# Altium project HPBIController.PrjPCB (part 1 of 5)
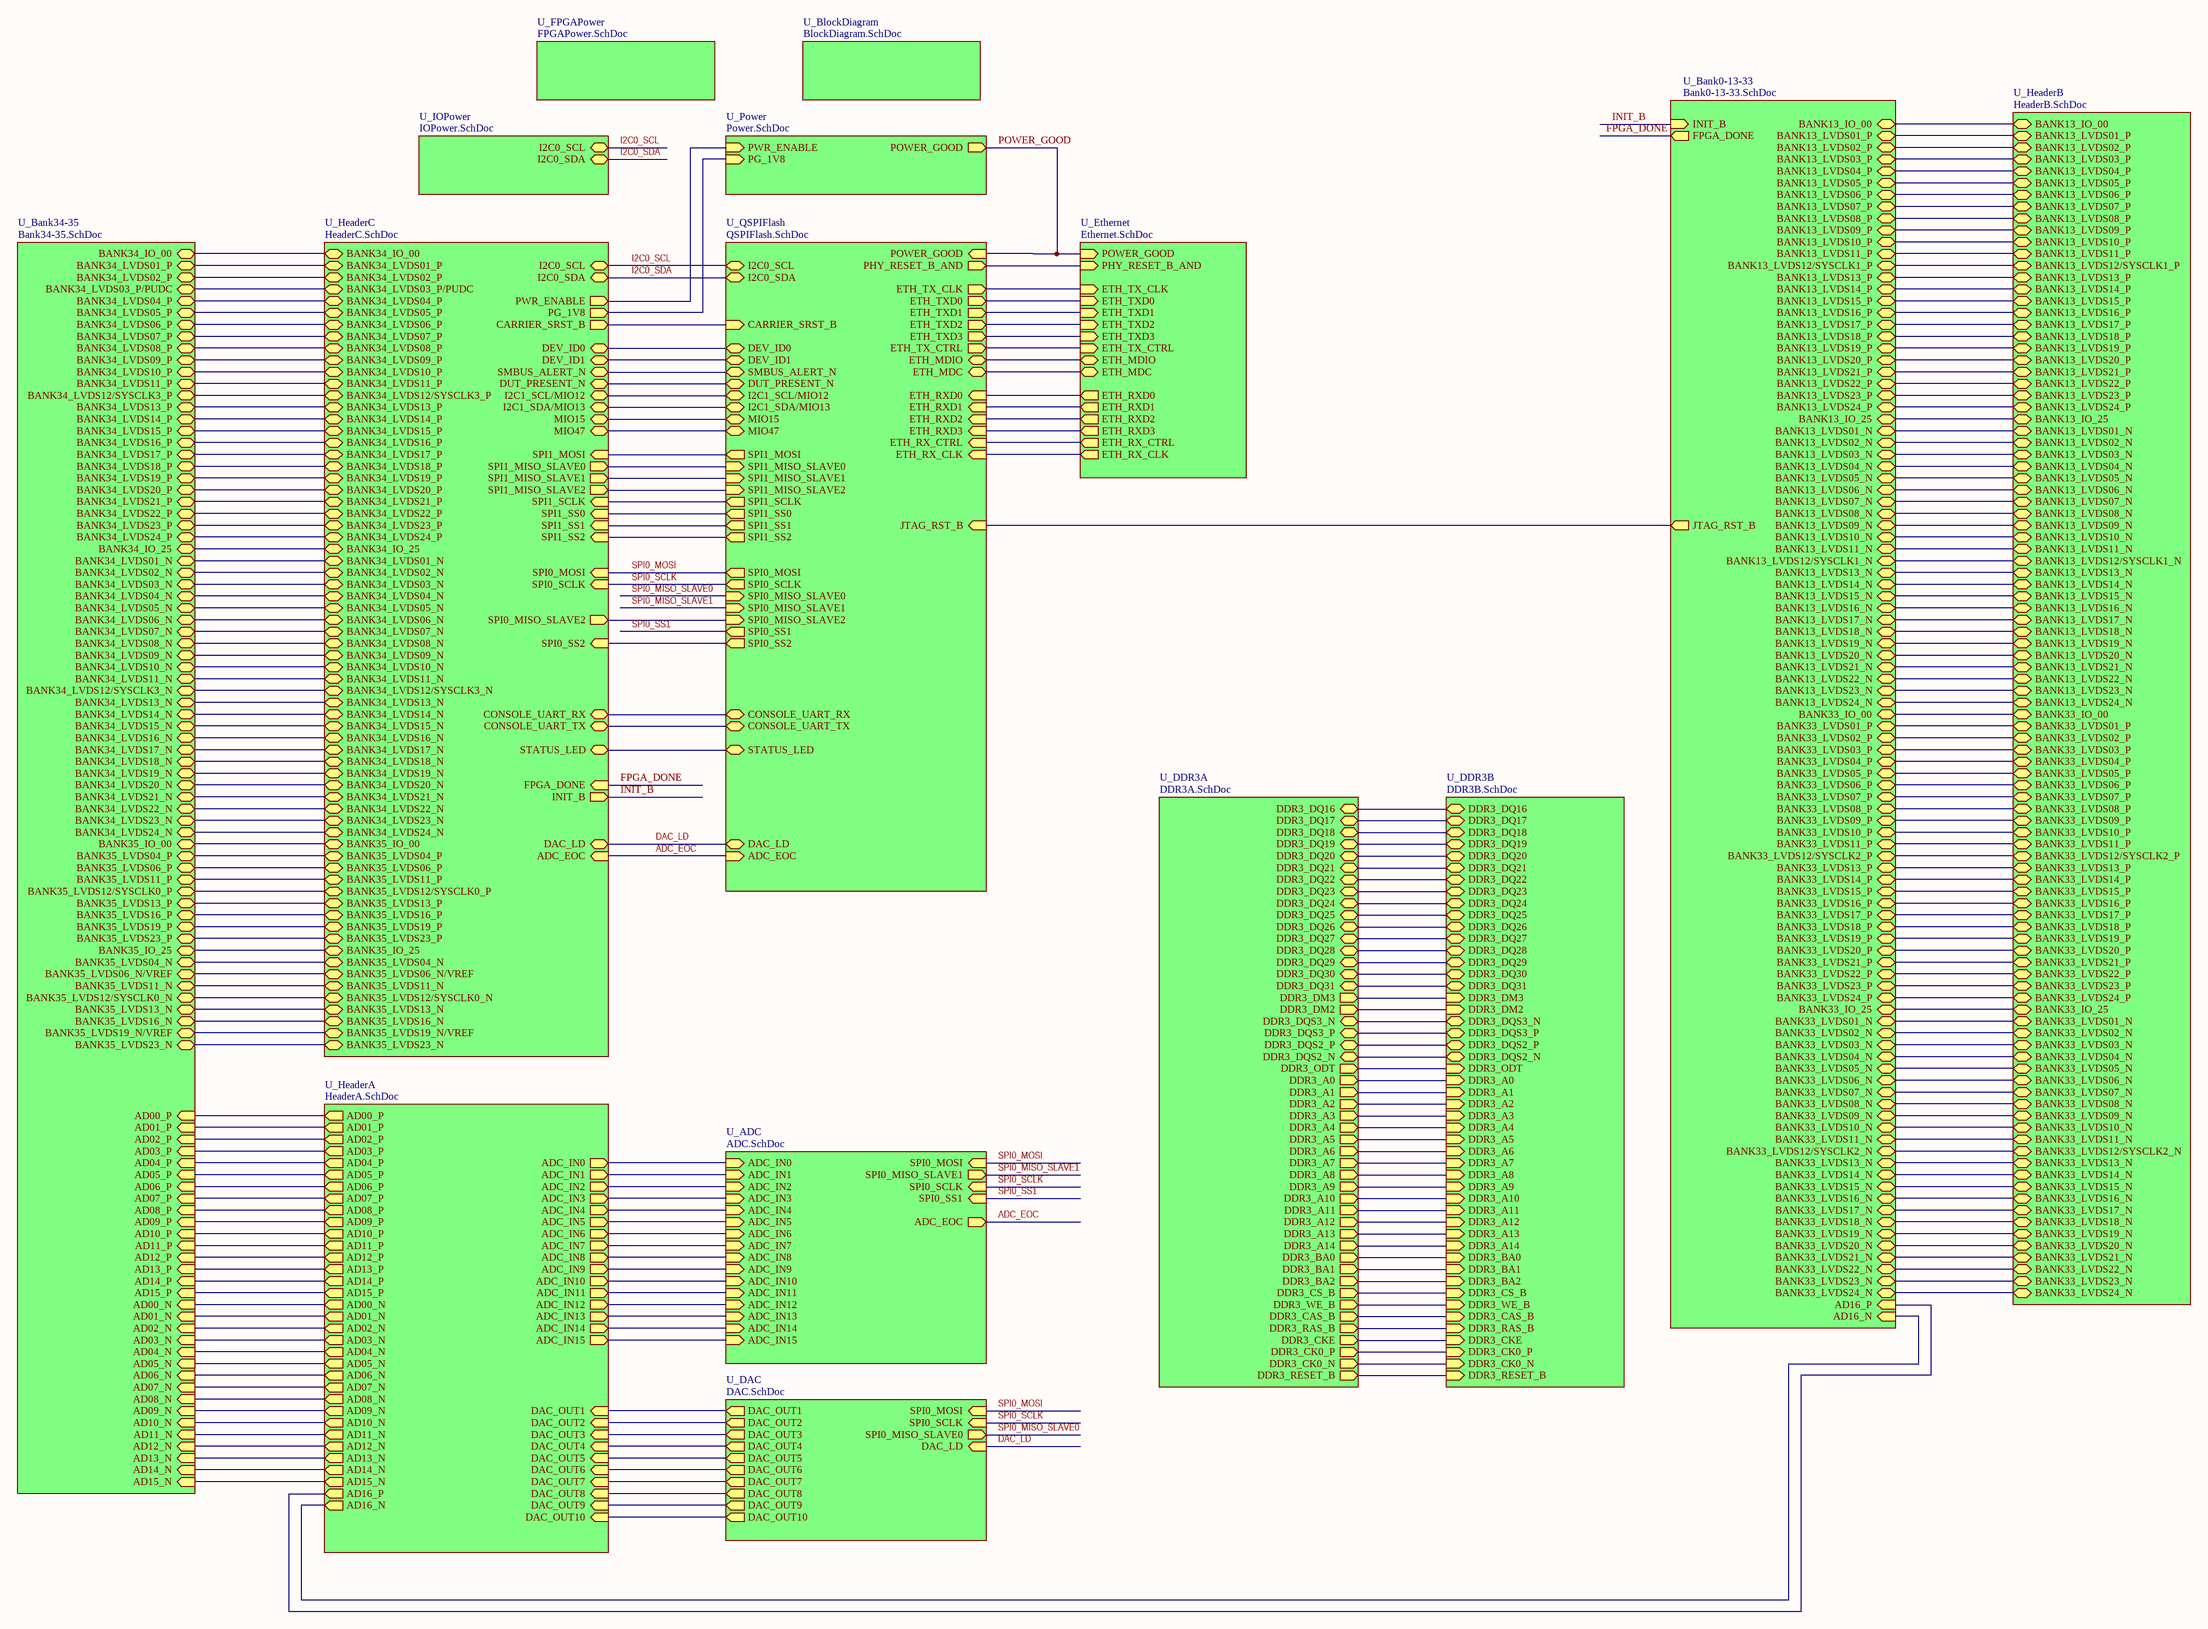
[diagram p0: Top.SchDoc]
10 sheets, 294 parts. Net scope: hierarchical (ports join the sheet entries above them; power ports are global).
Board file: HPBIController.PcbDoc
Sheets:
  Top.SchDoc
    U_Bank0-13-33 = Bank0-13-33.SchDoc
    U_DDR3A = DDR3A.SchDoc
    U_Ethernet = Ethernet.SchDoc
    U_FPGAPower = FPGAPower.SchDoc
    U_HeaderA = HeaderA.SchDoc
    U_HeaderB = HeaderB.SchDoc
    U_HeaderC = HeaderC.SchDoc
    U_IOPower = IOPower.SchDoc
    U_QSPIFlash = QSPIFlash.SchDoc

## Sheet Top.SchDoc: 02290_Sonoma_Controller
size C; ApprovedBy: J Johnson; CheckedBy: J Johnson; Author: sdfasdfdfAEFfasdFfaF; DrawnBy: J Johnson; Organization: Opsero Electronic Design; Address1: 21-915 Av. Marguerite-Bourgeoys; Address2: Québec (QC); Address3: G1S 3X4; DocumentNumber: OP009-001-SCH; Revision: B-1; SheetNumber: 01; SheetTotal: 16; Tel1: (581) 308-8830; Tel2: (581) 308-8830; Project: 02290_Sonoma_Controller; CheckedDate: yyyy-mm-dd; Sheet: Block diagram; PageSetup: Record=PageOptions|CenterHorizontal=True|CenterVertical=True|PrintScale=1.08|XCorrection=1.00|YCorrection=1.00|PrintKind=0|BorderSize=5000000|LeftOffset=0|BottomOffset=0|Orientation=2|PaperLength=1000|PaperWidth=1000|Scale=100|PaperSource=7|PrintQuality=-4|MediaType=1|DitherType=10|PaperKind=Tabloid     [11 x 17 in]|PrintScaleMode=1; DrawDate: 2013-12-13; SchTitle: 02290_Sonoma_Controller; RevDescription: Removed QSPI, JP4/5, temp mon, JP6, U31; RevDate: 2019-05-24; RevBy: J Johnson; RevDescription2: Replaced D1 with RB521S30, J2 with L834-1G1T-S7; RevDescription3: Replaced FETs with TSM900N06CW RPG

### Sub-sheets
U_ADC = ADC.SchDoc (file not in this document): SPI0_MOSI (in), SPI0_MISO_SLAVE1 (out), SPI0_SCLK (in), SPI0_SS1 (in), ADC_IN0 (in), ADC_IN1 (in), ADC_IN2 (in), ADC_IN3 (in), ADC_IN4 (in), ADC_IN5 (in), ADC_IN6 (in), ADC_IN7 (in), ADC_IN8 (in), ADC_IN9 (in), ADC_IN10 (in), ADC_IN11 (in), ADC_IN12 (in), ADC_IN13 (in), ADC_IN14 (in), ADC_IN15 (in), ADC_EOC (out)
U_Bank0-13-33 = Bank0-13-33.SchDoc: FPGA_DONE (out), INIT_B (in), BANK13_IO_00 (bidir), BANK13_LVDS01_P (bidir), BANK13_LVDS02_P (bidir), BANK13_LVDS03_P (bidir), BANK13_LVDS04_P (bidir), BANK13_LVDS05_P (bidir), BANK13_LVDS06_P (bidir), BANK13_LVDS07_P (bidir), BANK13_LVDS08_P (bidir), BANK13_LVDS09_P (bidir), BANK13_LVDS10_P (bidir), BANK13_LVDS11_P (bidir), BANK13_LVDS13_P (bidir), BANK13_LVDS14_P (bidir), BANK13_LVDS15_P (bidir), BANK13_LVDS16_P (bidir), BANK13_LVDS17_P (bidir), BANK13_LVDS18_P (bidir), BANK13_LVDS19_P (bidir), BANK13_LVDS20_P (bidir), BANK13_LVDS21_P (bidir), BANK13_LVDS22_P (bidir), BANK13_LVDS23_P (bidir), BANK13_LVDS24_P (bidir), BANK13_IO_25 (bidir), BANK13_LVDS01_N (bidir), BANK13_LVDS02_N (bidir), BANK13_LVDS03_N (bidir), BANK13_LVDS04_N (bidir), BANK13_LVDS05_N (bidir), BANK13_LVDS06_N (bidir), BANK13_LVDS07_N (bidir), BANK13_LVDS08_N (bidir), BANK13_LVDS09_N (bidir), BANK13_LVDS10_N (bidir), BANK13_LVDS11_N (bidir), BANK13_LVDS13_N (bidir), BANK13_LVDS14_N (bidir), BANK13_LVDS15_N (bidir), BANK13_LVDS16_N (bidir), BANK13_LVDS17_N (bidir), BANK13_LVDS18_N (bidir), BANK13_LVDS19_N (bidir), BANK13_LVDS20_N (bidir), BANK13_LVDS21_N (bidir), BANK13_LVDS22_N (bidir), BANK13_LVDS23_N (bidir), BANK13_LVDS24_N (bidir), BANK33_IO_00 (bidir), BANK33_LVDS01_P (bidir), BANK33_LVDS02_P (bidir), BANK33_LVDS03_P (bidir), BANK33_LVDS04_P (bidir), BANK33_LVDS05_P (bidir), BANK33_LVDS06_P (bidir), BANK33_LVDS07_P (bidir), BANK33_LVDS08_P (bidir), BANK33_LVDS09_P (bidir), BANK33_LVDS10_P (bidir), BANK33_LVDS11_P (bidir), BANK33_LVDS13_P (bidir), BANK33_LVDS14_P (bidir), BANK33_LVDS15_P (bidir), BANK33_LVDS16_P (bidir), BANK33_LVDS17_P (bidir), BANK33_LVDS18_P (bidir), BANK33_LVDS19_P (bidir), BANK33_LVDS20_P (bidir), BANK33_LVDS21_P (bidir), BANK33_LVDS22_P (bidir), BANK33_LVDS23_P (bidir), BANK33_LVDS24_P (bidir), BANK33_IO_25 (bidir), BANK33_LVDS01_N (bidir), BANK33_LVDS02_N (bidir), BANK33_LVDS03_N (bidir), BANK33_LVDS04_N (bidir), BANK33_LVDS05_N (bidir), BANK33_LVDS06_N (bidir), BANK33_LVDS07_N (bidir), BANK33_LVDS08_N (bidir), BANK33_LVDS09_N (bidir), BANK33_LVDS10_N (bidir), BANK33_LVDS11_N (bidir), BANK33_LVDS13_N (bidir), BANK33_LVDS14_N (bidir), BANK33_LVDS15_N (bidir), BANK33_LVDS16_N (bidir), BANK33_LVDS17_N (bidir), BANK33_LVDS18_N (bidir), BANK33_LVDS19_N (bidir), BANK33_LVDS20_N (bidir), BANK33_LVDS21_N (bidir), BANK33_LVDS22_N (bidir), BANK33_LVDS23_N (bidir), BANK33_LVDS24_N (bidir), AD16_P (in), AD16_N (in), JTAG_RST_B (out), BANK13_LVDS12/SYSCLK1_P (bidir), BANK13_LVDS12/SYSCLK1_N (bidir), BANK33_LVDS12/SYSCLK2_P (bidir), BANK33_LVDS12/SYSCLK2_N (bidir)
U_Bank34-35 = Bank34-35.SchDoc (file not in this document): BANK34_IO_00 (bidir), BANK34_LVDS01_P (bidir), BANK34_LVDS02_P (bidir), BANK34_LVDS03_P/PUDC (bidir), BANK34_LVDS04_P (bidir), BANK34_LVDS05_P (bidir), BANK34_LVDS06_P (bidir), BANK34_LVDS07_P (bidir), BANK34_LVDS08_P (bidir), BANK34_LVDS09_P (bidir), BANK34_LVDS10_P (bidir), BANK34_LVDS11_P (bidir), BANK34_LVDS13_P (bidir), BANK34_LVDS14_P (bidir), BANK34_LVDS15_P (bidir), BANK34_LVDS16_P (bidir), BANK34_LVDS17_P (bidir), BANK34_LVDS18_P (bidir), BANK34_LVDS19_P (bidir), BANK34_LVDS20_P (bidir), BANK34_LVDS21_P (bidir), BANK34_LVDS22_P (bidir), BANK34_LVDS23_P (bidir), BANK34_LVDS24_P (bidir), BANK34_IO_25 (bidir), BANK34_LVDS01_N (bidir), BANK34_LVDS02_N (bidir), BANK34_LVDS03_N (bidir), BANK34_LVDS04_N (bidir), BANK34_LVDS05_N (bidir), BANK34_LVDS06_N (bidir), BANK34_LVDS07_N (bidir), BANK34_LVDS08_N (bidir), BANK34_LVDS09_N (bidir), BANK34_LVDS10_N (bidir), BANK34_LVDS11_N (bidir), BANK34_LVDS13_N (bidir), BANK34_LVDS14_N (bidir), BANK34_LVDS15_N (bidir), BANK34_LVDS16_N (bidir), BANK34_LVDS17_N (bidir), BANK34_LVDS18_N (bidir), BANK34_LVDS19_N (bidir), BANK34_LVDS20_N (bidir), BANK34_LVDS21_N (bidir), BANK34_LVDS22_N (bidir), BANK34_LVDS23_N (bidir), BANK34_LVDS24_N (bidir), BANK35_IO_00 (bidir), BANK35_LVDS04_P (bidir), BANK35_LVDS06_P (bidir), BANK35_LVDS11_P (bidir), BANK35_LVDS13_P (bidir), BANK35_LVDS16_P (bidir), BANK35_LVDS19_P (bidir), BANK35_LVDS23_P (bidir), BANK35_IO_25 (bidir), BANK35_LVDS04_N (bidir), BANK35_LVDS06_N/VREF (bidir), BANK35_LVDS11_N (bidir), BANK35_LVDS13_N (bidir), BANK35_LVDS16_N (bidir), BANK35_LVDS19_N/VREF (bidir), BANK35_LVDS23_N (bidir), AD00_P (in), AD01_P (in), AD02_P (in), AD03_P (in), AD04_P (in), AD05_P (in), AD06_P (in), AD07_P (in), AD08_P (in), AD09_P (in), AD10_P (in), AD11_P (in), AD12_P (in), AD13_P (in), AD14_P (in), AD15_P (in), AD00_N (in), AD01_N (in), AD02_N (in), AD03_N (in), AD04_N (in), AD05_N (in), AD06_N (in), AD07_N (in), AD08_N (in), AD09_N (in), AD10_N (in), AD11_N (in), AD12_N (in), AD13_N (in), AD14_N (in), AD15_N (in), BANK34_LVDS12/SYSCLK3_P (bidir), BANK34_LVDS12/SYSCLK3_N (bidir), BANK35_LVDS12/SYSCLK0_P (bidir), BANK35_LVDS12/SYSCLK0_N (bidir)
U_BlockDiagram = BlockDiagram.SchDoc (file not in this document): no entries
U_DAC = DAC.SchDoc (file not in this document): DAC_OUT1 (out), DAC_OUT2 (out), DAC_OUT3 (out), DAC_OUT4 (out), DAC_OUT5 (out), DAC_OUT6 (out), DAC_OUT7 (out), DAC_OUT8 (out), DAC_OUT9 (out), DAC_OUT10 (out), SPI0_MOSI (in), SPI0_SCLK (in), DAC_LD (in), SPI0_MISO_SLAVE0 (out)
U_DDR3A = DDR3A.SchDoc: DDR3_DQ16 (bidir), DDR3_DQ17 (bidir), DDR3_DQ18 (bidir), DDR3_DQ19 (bidir), DDR3_DQ20 (bidir), DDR3_DQ21 (bidir), DDR3_DQ22 (bidir), DDR3_DQ23 (bidir), DDR3_DQ24 (bidir), DDR3_DQ25 (bidir), DDR3_DQ26 (bidir), DDR3_DQ27 (bidir), DDR3_DQ28 (bidir), DDR3_DQ29 (bidir), DDR3_DQ30 (bidir), DDR3_DQ31 (bidir), DDR3_DM2 (out), DDR3_DM3 (out), DDR3_DQS2_P (bidir), DDR3_DQS2_N (bidir), DDR3_DQS3_N (bidir), DDR3_DQS3_P (bidir), DDR3_A0 (out), DDR3_A1 (out), DDR3_A2 (out), DDR3_A3 (out), DDR3_A4 (out), DDR3_A5 (out), DDR3_A6 (out), DDR3_A7 (out), DDR3_A8 (out), DDR3_A9 (out), DDR3_A10 (out), DDR3_A11 (out), DDR3_A12 (out), DDR3_A13 (out), DDR3_A14 (out), DDR3_BA0 (out), DDR3_BA1 (out), DDR3_BA2 (out), DDR3_CK0_P (out), DDR3_CK0_N (out), DDR3_CKE (out), DDR3_CS_B (out), DDR3_RAS_B (out), DDR3_CAS_B (out), DDR3_WE_B (out), DDR3_ODT (out), DDR3_RESET_B (out)
U_DDR3B = DDR3B.SchDoc (file not in this document): DDR3_DQ24 (bidir), DDR3_DQ25 (bidir), DDR3_DQ26 (bidir), DDR3_DQ27 (bidir), DDR3_DQ28 (bidir), DDR3_DQ29 (bidir), DDR3_DQ30 (bidir), DDR3_DQ31 (bidir), DDR3_DQ16 (bidir), DDR3_DQ17 (bidir), DDR3_DQ18 (bidir), DDR3_DQ19 (bidir), DDR3_DQ20 (bidir), DDR3_DQ21 (bidir), DDR3_DQ22 (bidir), DDR3_DQ23 (bidir), DDR3_DM3 (in), DDR3_DM2 (in), DDR3_DQS3_N (bidir), DDR3_DQS3_P (bidir), DDR3_DQS2_P (bidir), DDR3_DQS2_N (bidir), DDR3_ODT (in), DDR3_A0 (in), DDR3_A1 (in), DDR3_A2 (in), DDR3_A3 (in), DDR3_A4 (in), DDR3_A5 (in), DDR3_A6 (in), DDR3_A7 (in), DDR3_A8 (in), DDR3_A9 (in), DDR3_A10 (in), DDR3_A11 (in), DDR3_A12 (in), DDR3_A13 (in), DDR3_A14 (in), DDR3_BA0 (in), DDR3_BA1 (in), DDR3_BA2 (in), DDR3_CS_B (in), DDR3_WE_B (in), DDR3_CAS_B (in), DDR3_RAS_B (in), DDR3_CKE (in), DDR3_CK0_P (in), DDR3_CK0_N (in), DDR3_RESET_B (in)
U_Ethernet = Ethernet.SchDoc: POWER_GOOD (in), ETH_TX_CLK (in), ETH_TXD0 (in), ETH_TXD1 (in), ETH_TXD2 (in), ETH_TXD3 (in), ETH_RXD0 (out), ETH_RXD1 (out), ETH_RXD2 (out), ETH_RXD3 (out), ETH_TX_CTRL (in), ETH_RX_CTRL (out), ETH_RX_CLK (out), ETH_MDIO (bidir), ETH_MDC (bidir), PHY_RESET_B_AND (in)
U_FPGAPower = FPGAPower.SchDoc: no entries
U_HeaderA = HeaderA.SchDoc: AD00_P (out), AD01_P (out), AD02_P (out), AD03_P (out), AD04_P (out), AD05_P (out), AD06_P (out), AD07_P (out), AD08_P (out), AD09_P (out), AD10_P (out), AD11_P (out), AD12_P (out), AD13_P (out), AD14_P (out), AD15_P (out), AD00_N (out), AD01_N (out), AD02_N (out), AD03_N (out), AD04_N (out), AD05_N (out), AD06_N (out), AD07_N (out), AD08_N (out), AD09_N (out), AD10_N (out), AD11_N (out), AD12_N (out), AD13_N (out), AD14_N (out), AD15_N (out), AD16_P (out), AD16_N (out), DAC_OUT1 (in), DAC_OUT2 (in), DAC_OUT3 (in), DAC_OUT4 (in), DAC_OUT5 (in), DAC_OUT6 (in), DAC_OUT7 (in), DAC_OUT8 (in), DAC_OUT9 (in), DAC_OUT10 (in), ADC_IN0 (out), ADC_IN1 (out), ADC_IN2 (out), ADC_IN3 (out), ADC_IN4 (out), ADC_IN5 (out), ADC_IN6 (out), ADC_IN7 (out), ADC_IN8 (out), ADC_IN9 (out), ADC_IN10 (out), ADC_IN11 (out), ADC_IN12 (out), ADC_IN13 (out), ADC_IN14 (out), ADC_IN15 (out)
U_HeaderB = HeaderB.SchDoc: BANK13_IO_00 (bidir), BANK13_LVDS01_P (bidir), BANK13_LVDS02_P (bidir), BANK13_LVDS03_P (bidir), BANK13_LVDS04_P (bidir), BANK13_LVDS05_P (bidir), BANK13_LVDS06_P (bidir), BANK13_LVDS07_P (bidir), BANK13_LVDS08_P (bidir), BANK13_LVDS09_P (bidir), BANK13_LVDS10_P (bidir), BANK13_LVDS11_P (bidir), BANK13_LVDS12/SYSCLK1_P (bidir), BANK13_LVDS13_P (bidir), BANK13_LVDS14_P (bidir), BANK13_LVDS15_P (bidir), BANK13_LVDS16_P (bidir), BANK13_LVDS17_P (bidir), BANK13_LVDS18_P (bidir), BANK13_LVDS19_P (bidir), BANK13_LVDS20_P (bidir), BANK13_LVDS21_P (bidir), BANK13_LVDS22_P (bidir), BANK13_LVDS23_P (bidir), BANK13_LVDS24_P (bidir), BANK13_IO_25 (bidir), BANK13_LVDS01_N (bidir), BANK13_LVDS02_N (bidir), BANK13_LVDS03_N (bidir), BANK13_LVDS04_N (bidir), BANK13_LVDS05_N (bidir), BANK13_LVDS06_N (bidir), BANK13_LVDS07_N (bidir), BANK13_LVDS08_N (bidir), BANK13_LVDS09_N (bidir), BANK13_LVDS10_N (bidir), BANK13_LVDS11_N (bidir), BANK13_LVDS12/SYSCLK1_N (bidir), BANK13_LVDS13_N (bidir), BANK13_LVDS14_N (bidir), BANK13_LVDS15_N (bidir), BANK13_LVDS16_N (bidir), BANK13_LVDS17_N (bidir), BANK13_LVDS18_N (bidir), BANK13_LVDS19_N (bidir), BANK13_LVDS20_N (bidir), BANK13_LVDS21_N (bidir), BANK13_LVDS22_N (bidir), BANK13_LVDS23_N (bidir), BANK13_LVDS24_N (bidir), BANK33_IO_00 (bidir), BANK33_LVDS01_P (bidir), BANK33_LVDS02_P (bidir), BANK33_LVDS03_P (bidir), BANK33_LVDS04_P (bidir), BANK33_LVDS05_P (bidir), BANK33_LVDS06_P (bidir), BANK33_LVDS07_P (bidir), BANK33_LVDS08_P (bidir), BANK33_LVDS09_P (bidir), BANK33_LVDS10_P (bidir), BANK33_LVDS11_P (bidir), BANK33_LVDS12/SYSCLK2_P (bidir), BANK33_LVDS13_P (bidir), BANK33_LVDS14_P (bidir), BANK33_LVDS15_P (bidir), BANK33_LVDS16_P (bidir), BANK33_LVDS17_P (bidir), BANK33_LVDS18_P (bidir), BANK33_LVDS19_P (bidir), BANK33_LVDS20_P (bidir), BANK33_LVDS21_P (bidir), BANK33_LVDS22_P (bidir), BANK33_LVDS23_P (bidir), BANK33_LVDS24_P (bidir), BANK33_IO_25 (bidir), BANK33_LVDS01_N (bidir), BANK33_LVDS02_N (bidir), BANK33_LVDS03_N (bidir), BANK33_LVDS04_N (bidir), BANK33_LVDS05_N (bidir), BANK33_LVDS06_N (bidir), BANK33_LVDS07_N (bidir), BANK33_LVDS08_N (bidir), BANK33_LVDS09_N (bidir), BANK33_LVDS10_N (bidir), BANK33_LVDS11_N (bidir), BANK33_LVDS12/SYSCLK2_N (bidir), BANK33_LVDS13_N (bidir), BANK33_LVDS14_N (bidir), BANK33_LVDS15_N (bidir), BANK33_LVDS16_N (bidir), BANK33_LVDS17_N (bidir), BANK33_LVDS18_N (bidir), BANK33_LVDS19_N (bidir), BANK33_LVDS20_N (bidir), BANK33_LVDS21_N (bidir), BANK33_LVDS22_N (bidir), BANK33_LVDS23_N (bidir), BANK33_LVDS24_N (bidir)
U_HeaderC = HeaderC.SchDoc: BANK34_IO_00 (bidir), BANK34_LVDS01_P (bidir), BANK34_LVDS02_P (bidir), BANK34_LVDS03_P/PUDC (bidir), BANK34_LVDS04_P (bidir), BANK34_LVDS05_P (bidir), BANK34_LVDS06_P (bidir), BANK34_LVDS07_P (bidir), BANK34_LVDS08_P (bidir), BANK34_LVDS09_P (bidir), BANK34_LVDS10_P (bidir), BANK34_LVDS11_P (bidir), BANK34_LVDS12/SYSCLK3_P (bidir), BANK34_LVDS13_P (bidir), BANK34_LVDS14_P (bidir), BANK34_LVDS15_P (bidir), BANK34_LVDS16_P (bidir), BANK34_LVDS17_P (bidir), BANK34_LVDS18_P (bidir), BANK34_LVDS19_P (bidir), BANK34_LVDS20_P (bidir), BANK34_LVDS21_P (bidir), BANK34_LVDS22_P (bidir), BANK34_LVDS23_P (bidir), BANK34_LVDS24_P (bidir), BANK34_IO_25 (bidir), BANK34_LVDS01_N (bidir), BANK34_LVDS02_N (bidir), BANK34_LVDS03_N (bidir), BANK34_LVDS04_N (bidir), BANK34_LVDS05_N (bidir), BANK34_LVDS06_N (bidir), BANK34_LVDS07_N (bidir), BANK34_LVDS08_N (bidir), BANK34_LVDS09_N (bidir), BANK34_LVDS10_N (bidir), BANK34_LVDS11_N (bidir), BANK34_LVDS12/SYSCLK3_N (bidir), BANK34_LVDS13_N (bidir), BANK34_LVDS14_N (bidir), BANK34_LVDS15_N (bidir), BANK34_LVDS16_N (bidir), BANK34_LVDS17_N (bidir), BANK34_LVDS18_N (bidir), BANK34_LVDS19_N (bidir), BANK34_LVDS20_N (bidir), BANK34_LVDS21_N (bidir), BANK34_LVDS22_N (bidir), BANK34_LVDS23_N (bidir), BANK34_LVDS24_N (bidir), BANK35_IO_00 (bidir), BANK35_LVDS04_P (bidir), BANK35_LVDS06_P (bidir), BANK35_LVDS11_P (bidir), BANK35_LVDS12/SYSCLK0_P (bidir), BANK35_LVDS13_P (bidir), BANK35_LVDS16_P (bidir), BANK35_LVDS19_P (bidir), BANK35_LVDS23_P (bidir), BANK35_IO_25 (bidir), BANK35_LVDS04_N (bidir), BANK35_LVDS06_N/VREF (bidir), BANK35_LVDS11_N (bidir), BANK35_LVDS12/SYSCLK0_N (bidir), BANK35_LVDS13_N (bidir), BANK35_LVDS16_N (bidir), BANK35_LVDS19_N/VREF (bidir), BANK35_LVDS23_N (bidir), DEV_ID0 (bidir), DEV_ID1 (bidir), SMBUS_ALERT_N (bidir), I2C1_SCL/MIO12 (bidir), I2C1_SDA/MIO13 (bidir), DAC_LD (bidir), ADC_EOC (in), SPI1_MOSI (in), SPI1_SCLK (in), SPI1_SS0 (in), SPI1_SS1 (in), SPI1_SS2 (in), CONSOLE_UART_RX (bidir), CONSOLE_UART_TX (bidir), I2C0_SCL (bidir), I2C0_SDA (bidir), DUT_PRESENT_N (bidir), CARRIER_SRST_B (out), STATUS_LED (bidir), FPGA_DONE (in), INIT_B (out), PWR_ENABLE (out), PG_1V8 (out), MIO15 (bidir), SPI1_MISO_SLAVE0 (out), SPI1_MISO_SLAVE1 (out), SPI1_MISO_SLAVE2 (out), SPI0_MOSI (in), SPI0_SCLK (in), SPI0_SS2 (in), SPI0_MISO_SLAVE2 (out), MIO47 (bidir)
U_IOPower = IOPower.SchDoc: I2C0_SCL (bidir), I2C0_SDA (bidir)
U_Power = Power.SchDoc (file not in this document): PWR_ENABLE (in), POWER_GOOD (out), PG_1V8 (in)
U_QSPIFlash = QSPIFlash.SchDoc: JTAG_RST_B (in), CARRIER_SRST_B (in), ETH_TX_CLK (out), ETH_TXD0 (out), ETH_TXD1 (out), ETH_TXD2 (out), ETH_TXD3 (out), ETH_RXD0 (in), ETH_RXD1 (in), ETH_RXD2 (in), ETH_RXD3 (in), ETH_TX_CTRL (out), ETH_RX_CTRL (in), ETH_RX_CLK (in), ETH_MDIO (bidir), ETH_MDC (bidir), PHY_RESET_B_AND (out), DEV_ID0 (bidir), DEV_ID1 (bidir), SMBUS_ALERT_N (bidir), I2C1_SCL/MIO12 (bidir), I2C1_SDA/MIO13 (bidir), DAC_LD (bidir), ADC_EOC (in), SPI0_MOSI (out), SPI0_SCLK (out), CONSOLE_UART_RX (bidir), CONSOLE_UART_TX (bidir), I2C0_SCL (bidir), I2C0_SDA (bidir), POWER_GOOD (in), DUT_PRESENT_N (bidir), SPI1_MOSI (out), SPI1_SCLK (out), STATUS_LED (bidir), MIO15 (bidir), SPI1_MISO_SLAVE0 (in), SPI1_MISO_SLAVE1 (in), SPI1_MISO_SLAVE2 (in), SPI0_SS1 (out), SPI1_SS0 (out), SPI1_SS1 (out), SPI1_SS2 (out), SPI0_SS2 (out), SPI0_MISO_SLAVE0 (in), SPI0_MISO_SLAVE2 (in), SPI0_MISO_SLAVE1 (in), MIO47 (bidir)

### Nets
AD00_N: sheet U_Bank34-35/AD00_N, sheet U_HeaderA/AD00_N
AD00_P: sheet U_Bank34-35/AD00_P, sheet U_HeaderA/AD00_P
AD01_N: sheet U_Bank34-35/AD01_N, sheet U_HeaderA/AD01_N
AD01_P: sheet U_Bank34-35/AD01_P, sheet U_HeaderA/AD01_P
AD02_N: sheet U_Bank34-35/AD02_N, sheet U_HeaderA/AD02_N
AD02_P: sheet U_Bank34-35/AD02_P, sheet U_HeaderA/AD02_P
AD03_N: sheet U_Bank34-35/AD03_N, sheet U_HeaderA/AD03_N
AD03_P: sheet U_Bank34-35/AD03_P, sheet U_HeaderA/AD03_P
AD04_N: sheet U_Bank34-35/AD04_N, sheet U_HeaderA/AD04_N
AD04_P: sheet U_Bank34-35/AD04_P, sheet U_HeaderA/AD04_P
AD05_N: sheet U_Bank34-35/AD05_N, sheet U_HeaderA/AD05_N
AD05_P: sheet U_Bank34-35/AD05_P, sheet U_HeaderA/AD05_P
AD06_N: sheet U_Bank34-35/AD06_N, sheet U_HeaderA/AD06_N
AD06_P: sheet U_Bank34-35/AD06_P, sheet U_HeaderA/AD06_P
AD07_N: sheet U_Bank34-35/AD07_N, sheet U_HeaderA/AD07_N
AD07_P: sheet U_Bank34-35/AD07_P, sheet U_HeaderA/AD07_P
AD08_N: sheet U_Bank34-35/AD08_N, sheet U_HeaderA/AD08_N
AD08_P: sheet U_Bank34-35/AD08_P, sheet U_HeaderA/AD08_P
AD09_N: sheet U_Bank34-35/AD09_N, sheet U_HeaderA/AD09_N
AD09_P: sheet U_Bank34-35/AD09_P, sheet U_HeaderA/AD09_P
AD10_N: sheet U_Bank34-35/AD10_N, sheet U_HeaderA/AD10_N
AD10_P: sheet U_Bank34-35/AD10_P, sheet U_HeaderA/AD10_P
AD11_N: sheet U_Bank34-35/AD11_N, sheet U_HeaderA/AD11_N
AD11_P: sheet U_Bank34-35/AD11_P, sheet U_HeaderA/AD11_P
AD12_N: sheet U_Bank34-35/AD12_N, sheet U_HeaderA/AD12_N
AD12_P: sheet U_Bank34-35/AD12_P, sheet U_HeaderA/AD12_P
AD13_N: sheet U_Bank34-35/AD13_N, sheet U_HeaderA/AD13_N
AD13_P: sheet U_Bank34-35/AD13_P, sheet U_HeaderA/AD13_P
AD14_N: sheet U_Bank34-35/AD14_N, sheet U_HeaderA/AD14_N
AD14_P: sheet U_Bank34-35/AD14_P, sheet U_HeaderA/AD14_P
AD15_N: sheet U_Bank34-35/AD15_N, sheet U_HeaderA/AD15_N
AD15_P: sheet U_Bank34-35/AD15_P, sheet U_HeaderA/AD15_P
AD16_N: sheet U_Bank0-13-33/AD16_N, sheet U_HeaderA/AD16_N
AD16_P: sheet U_Bank0-13-33/AD16_P, sheet U_HeaderA/AD16_P
ADC_EOC: sheet U_ADC/ADC_EOC, sheet U_HeaderC/ADC_EOC, sheet U_QSPIFlash/ADC_EOC
ADC_IN0: sheet U_ADC/ADC_IN0, sheet U_HeaderA/ADC_IN0
ADC_IN1: sheet U_ADC/ADC_IN1, sheet U_HeaderA/ADC_IN1
ADC_IN2: sheet U_ADC/ADC_IN2, sheet U_HeaderA/ADC_IN2
ADC_IN3: sheet U_ADC/ADC_IN3, sheet U_HeaderA/ADC_IN3
ADC_IN4: sheet U_ADC/ADC_IN4, sheet U_HeaderA/ADC_IN4
ADC_IN5: sheet U_ADC/ADC_IN5, sheet U_HeaderA/ADC_IN5
ADC_IN6: sheet U_ADC/ADC_IN6, sheet U_HeaderA/ADC_IN6
ADC_IN7: sheet U_ADC/ADC_IN7, sheet U_HeaderA/ADC_IN7
ADC_IN8: sheet U_ADC/ADC_IN8, sheet U_HeaderA/ADC_IN8
ADC_IN9: sheet U_ADC/ADC_IN9, sheet U_HeaderA/ADC_IN9
ADC_IN10: sheet U_ADC/ADC_IN10, sheet U_HeaderA/ADC_IN10
ADC_IN11: sheet U_ADC/ADC_IN11, sheet U_HeaderA/ADC_IN11
ADC_IN12: sheet U_ADC/ADC_IN12, sheet U_HeaderA/ADC_IN12
ADC_IN13: sheet U_ADC/ADC_IN13, sheet U_HeaderA/ADC_IN13
ADC_IN14: sheet U_ADC/ADC_IN14, sheet U_HeaderA/ADC_IN14
ADC_IN15: sheet U_ADC/ADC_IN15, sheet U_HeaderA/ADC_IN15
BANK13_IO_00: sheet U_Bank0-13-33/BANK13_IO_00, sheet U_HeaderB/BANK13_IO_00
BANK13_IO_25: sheet U_Bank0-13-33/BANK13_IO_25, sheet U_HeaderB/BANK13_IO_25
BANK13_LVDS01_N: sheet U_Bank0-13-33/BANK13_LVDS01_N, sheet U_HeaderB/BANK13_LVDS01_N
BANK13_LVDS01_P: sheet U_Bank0-13-33/BANK13_LVDS01_P, sheet U_HeaderB/BANK13_LVDS01_P
BANK13_LVDS02_N: sheet U_Bank0-13-33/BANK13_LVDS02_N, sheet U_HeaderB/BANK13_LVDS02_N
BANK13_LVDS02_P: sheet U_Bank0-13-33/BANK13_LVDS02_P, sheet U_HeaderB/BANK13_LVDS02_P
BANK13_LVDS03_N: sheet U_Bank0-13-33/BANK13_LVDS03_N, sheet U_HeaderB/BANK13_LVDS03_N
BANK13_LVDS03_P: sheet U_Bank0-13-33/BANK13_LVDS03_P, sheet U_HeaderB/BANK13_LVDS03_P
BANK13_LVDS04_N: sheet U_Bank0-13-33/BANK13_LVDS04_N, sheet U_HeaderB/BANK13_LVDS04_N
BANK13_LVDS04_P: sheet U_Bank0-13-33/BANK13_LVDS04_P, sheet U_HeaderB/BANK13_LVDS04_P
BANK13_LVDS05_N: sheet U_Bank0-13-33/BANK13_LVDS05_N, sheet U_HeaderB/BANK13_LVDS05_N
BANK13_LVDS05_P: sheet U_Bank0-13-33/BANK13_LVDS05_P, sheet U_HeaderB/BANK13_LVDS05_P
BANK13_LVDS06_N: sheet U_Bank0-13-33/BANK13_LVDS06_N, sheet U_HeaderB/BANK13_LVDS06_N
BANK13_LVDS06_P: sheet U_Bank0-13-33/BANK13_LVDS06_P, sheet U_HeaderB/BANK13_LVDS06_P
BANK13_LVDS07_N: sheet U_Bank0-13-33/BANK13_LVDS07_N, sheet U_HeaderB/BANK13_LVDS07_N
BANK13_LVDS07_P: sheet U_Bank0-13-33/BANK13_LVDS07_P, sheet U_HeaderB/BANK13_LVDS07_P
BANK13_LVDS08_N: sheet U_Bank0-13-33/BANK13_LVDS08_N, sheet U_HeaderB/BANK13_LVDS08_N
BANK13_LVDS08_P: sheet U_Bank0-13-33/BANK13_LVDS08_P, sheet U_HeaderB/BANK13_LVDS08_P
BANK13_LVDS09_N: sheet U_Bank0-13-33/BANK13_LVDS09_N, sheet U_HeaderB/BANK13_LVDS09_N
BANK13_LVDS09_P: sheet U_Bank0-13-33/BANK13_LVDS09_P, sheet U_HeaderB/BANK13_LVDS09_P
BANK13_LVDS10_N: sheet U_Bank0-13-33/BANK13_LVDS10_N, sheet U_HeaderB/BANK13_LVDS10_N
BANK13_LVDS10_P: sheet U_Bank0-13-33/BANK13_LVDS10_P, sheet U_HeaderB/BANK13_LVDS10_P
BANK13_LVDS11_N: sheet U_Bank0-13-33/BANK13_LVDS11_N, sheet U_HeaderB/BANK13_LVDS11_N
BANK13_LVDS11_P: sheet U_Bank0-13-33/BANK13_LVDS11_P, sheet U_HeaderB/BANK13_LVDS11_P
BANK13_LVDS12/SYSCLK1_N: sheet U_Bank0-13-33/BANK13_LVDS12/SYSCLK1_N, sheet U_HeaderB/BANK13_LVDS12/SYSCLK1_N
BANK13_LVDS12/SYSCLK1_P: sheet U_Bank0-13-33/BANK13_LVDS12/SYSCLK1_P, sheet U_HeaderB/BANK13_LVDS12/SYSCLK1_P
BANK13_LVDS13_N: sheet U_Bank0-13-33/BANK13_LVDS13_N, sheet U_HeaderB/BANK13_LVDS13_N
BANK13_LVDS13_P: sheet U_Bank0-13-33/BANK13_LVDS13_P, sheet U_HeaderB/BANK13_LVDS13_P
BANK13_LVDS14_N: sheet U_Bank0-13-33/BANK13_LVDS14_N, sheet U_HeaderB/BANK13_LVDS14_N
BANK13_LVDS14_P: sheet U_Bank0-13-33/BANK13_LVDS14_P, sheet U_HeaderB/BANK13_LVDS14_P
BANK13_LVDS15_N: sheet U_Bank0-13-33/BANK13_LVDS15_N, sheet U_HeaderB/BANK13_LVDS15_N
BANK13_LVDS15_P: sheet U_Bank0-13-33/BANK13_LVDS15_P, sheet U_HeaderB/BANK13_LVDS15_P
BANK13_LVDS16_N: sheet U_Bank0-13-33/BANK13_LVDS16_N, sheet U_HeaderB/BANK13_LVDS16_N
BANK13_LVDS16_P: sheet U_Bank0-13-33/BANK13_LVDS16_P, sheet U_HeaderB/BANK13_LVDS16_P
BANK13_LVDS17_N: sheet U_Bank0-13-33/BANK13_LVDS17_N, sheet U_HeaderB/BANK13_LVDS17_N
BANK13_LVDS17_P: sheet U_Bank0-13-33/BANK13_LVDS17_P, sheet U_HeaderB/BANK13_LVDS17_P
BANK13_LVDS18_N: sheet U_Bank0-13-33/BANK13_LVDS18_N, sheet U_HeaderB/BANK13_LVDS18_N
BANK13_LVDS18_P: sheet U_Bank0-13-33/BANK13_LVDS18_P, sheet U_HeaderB/BANK13_LVDS18_P
BANK13_LVDS19_N: sheet U_Bank0-13-33/BANK13_LVDS19_N, sheet U_HeaderB/BANK13_LVDS19_N
BANK13_LVDS19_P: sheet U_Bank0-13-33/BANK13_LVDS19_P, sheet U_HeaderB/BANK13_LVDS19_P
BANK13_LVDS20_N: sheet U_Bank0-13-33/BANK13_LVDS20_N, sheet U_HeaderB/BANK13_LVDS20_N
BANK13_LVDS20_P: sheet U_Bank0-13-33/BANK13_LVDS20_P, sheet U_HeaderB/BANK13_LVDS20_P
BANK13_LVDS21_N: sheet U_Bank0-13-33/BANK13_LVDS21_N, sheet U_HeaderB/BANK13_LVDS21_N
BANK13_LVDS21_P: sheet U_Bank0-13-33/BANK13_LVDS21_P, sheet U_HeaderB/BANK13_LVDS21_P
BANK13_LVDS22_N: sheet U_Bank0-13-33/BANK13_LVDS22_N, sheet U_HeaderB/BANK13_LVDS22_N
BANK13_LVDS22_P: sheet U_Bank0-13-33/BANK13_LVDS22_P, sheet U_HeaderB/BANK13_LVDS22_P
BANK13_LVDS23_N: sheet U_Bank0-13-33/BANK13_LVDS23_N, sheet U_HeaderB/BANK13_LVDS23_N
BANK13_LVDS23_P: sheet U_Bank0-13-33/BANK13_LVDS23_P, sheet U_HeaderB/BANK13_LVDS23_P
BANK13_LVDS24_N: sheet U_Bank0-13-33/BANK13_LVDS24_N, sheet U_HeaderB/BANK13_LVDS24_N
BANK13_LVDS24_P: sheet U_Bank0-13-33/BANK13_LVDS24_P, sheet U_HeaderB/BANK13_LVDS24_P
BANK33_IO_00: sheet U_Bank0-13-33/BANK33_IO_00, sheet U_HeaderB/BANK33_IO_00
BANK33_IO_25: sheet U_Bank0-13-33/BANK33_IO_25, sheet U_HeaderB/BANK33_IO_25
BANK33_LVDS01_N: sheet U_Bank0-13-33/BANK33_LVDS01_N, sheet U_HeaderB/BANK33_LVDS01_N
BANK33_LVDS01_P: sheet U_Bank0-13-33/BANK33_LVDS01_P, sheet U_HeaderB/BANK33_LVDS01_P
BANK33_LVDS02_N: sheet U_Bank0-13-33/BANK33_LVDS02_N, sheet U_HeaderB/BANK33_LVDS02_N
BANK33_LVDS02_P: sheet U_Bank0-13-33/BANK33_LVDS02_P, sheet U_HeaderB/BANK33_LVDS02_P
BANK33_LVDS03_N: sheet U_Bank0-13-33/BANK33_LVDS03_N, sheet U_HeaderB/BANK33_LVDS03_N
BANK33_LVDS03_P: sheet U_Bank0-13-33/BANK33_LVDS03_P, sheet U_HeaderB/BANK33_LVDS03_P
BANK33_LVDS04_N: sheet U_Bank0-13-33/BANK33_LVDS04_N, sheet U_HeaderB/BANK33_LVDS04_N
BANK33_LVDS04_P: sheet U_Bank0-13-33/BANK33_LVDS04_P, sheet U_HeaderB/BANK33_LVDS04_P
BANK33_LVDS05_N: sheet U_Bank0-13-33/BANK33_LVDS05_N, sheet U_HeaderB/BANK33_LVDS05_N
BANK33_LVDS05_P: sheet U_Bank0-13-33/BANK33_LVDS05_P, sheet U_HeaderB/BANK33_LVDS05_P
BANK33_LVDS06_N: sheet U_Bank0-13-33/BANK33_LVDS06_N, sheet U_HeaderB/BANK33_LVDS06_N
BANK33_LVDS06_P: sheet U_Bank0-13-33/BANK33_LVDS06_P, sheet U_HeaderB/BANK33_LVDS06_P
BANK33_LVDS07_N: sheet U_Bank0-13-33/BANK33_LVDS07_N, sheet U_HeaderB/BANK33_LVDS07_N
BANK33_LVDS07_P: sheet U_Bank0-13-33/BANK33_LVDS07_P, sheet U_HeaderB/BANK33_LVDS07_P
BANK33_LVDS08_N: sheet U_Bank0-13-33/BANK33_LVDS08_N, sheet U_HeaderB/BANK33_LVDS08_N
BANK33_LVDS08_P: sheet U_Bank0-13-33/BANK33_LVDS08_P, sheet U_HeaderB/BANK33_LVDS08_P
BANK33_LVDS09_N: sheet U_Bank0-13-33/BANK33_LVDS09_N, sheet U_HeaderB/BANK33_LVDS09_N
BANK33_LVDS09_P: sheet U_Bank0-13-33/BANK33_LVDS09_P, sheet U_HeaderB/BANK33_LVDS09_P
BANK33_LVDS10_N: sheet U_Bank0-13-33/BANK33_LVDS10_N, sheet U_HeaderB/BANK33_LVDS10_N
BANK33_LVDS10_P: sheet U_Bank0-13-33/BANK33_LVDS10_P, sheet U_HeaderB/BANK33_LVDS10_P
BANK33_LVDS11_N: sheet U_Bank0-13-33/BANK33_LVDS11_N, sheet U_HeaderB/BANK33_LVDS11_N
BANK33_LVDS11_P: sheet U_Bank0-13-33/BANK33_LVDS11_P, sheet U_HeaderB/BANK33_LVDS11_P
BANK33_LVDS12/SYSCLK2_N: sheet U_Bank0-13-33/BANK33_LVDS12/SYSCLK2_N, sheet U_HeaderB/BANK33_LVDS12/SYSCLK2_N
BANK33_LVDS12/SYSCLK2_P: sheet U_Bank0-13-33/BANK33_LVDS12/SYSCLK2_P, sheet U_HeaderB/BANK33_LVDS12/SYSCLK2_P
BANK33_LVDS13_N: sheet U_Bank0-13-33/BANK33_LVDS13_N, sheet U_HeaderB/BANK33_LVDS13_N
BANK33_LVDS13_P: sheet U_Bank0-13-33/BANK33_LVDS13_P, sheet U_HeaderB/BANK33_LVDS13_P
BANK33_LVDS14_N: sheet U_Bank0-13-33/BANK33_LVDS14_N, sheet U_HeaderB/BANK33_LVDS14_N
BANK33_LVDS14_P: sheet U_Bank0-13-33/BANK33_LVDS14_P, sheet U_HeaderB/BANK33_LVDS14_P
BANK33_LVDS15_N: sheet U_Bank0-13-33/BANK33_LVDS15_N, sheet U_HeaderB/BANK33_LVDS15_N
BANK33_LVDS15_P: sheet U_Bank0-13-33/BANK33_LVDS15_P, sheet U_HeaderB/BANK33_LVDS15_P
BANK33_LVDS16_N: sheet U_Bank0-13-33/BANK33_LVDS16_N, sheet U_HeaderB/BANK33_LVDS16_N
BANK33_LVDS16_P: sheet U_Bank0-13-33/BANK33_LVDS16_P, sheet U_HeaderB/BANK33_LVDS16_P
BANK33_LVDS17_N: sheet U_Bank0-13-33/BANK33_LVDS17_N, sheet U_HeaderB/BANK33_LVDS17_N
BANK33_LVDS17_P: sheet U_Bank0-13-33/BANK33_LVDS17_P, sheet U_HeaderB/BANK33_LVDS17_P
BANK33_LVDS18_N: sheet U_Bank0-13-33/BANK33_LVDS18_N, sheet U_HeaderB/BANK33_LVDS18_N
BANK33_LVDS18_P: sheet U_Bank0-13-33/BANK33_LVDS18_P, sheet U_HeaderB/BANK33_LVDS18_P
BANK33_LVDS19_N: sheet U_Bank0-13-33/BANK33_LVDS19_N, sheet U_HeaderB/BANK33_LVDS19_N
BANK33_LVDS19_P: sheet U_Bank0-13-33/BANK33_LVDS19_P, sheet U_HeaderB/BANK33_LVDS19_P
BANK33_LVDS20_N: sheet U_Bank0-13-33/BANK33_LVDS20_N, sheet U_HeaderB/BANK33_LVDS20_N
BANK33_LVDS20_P: sheet U_Bank0-13-33/BANK33_LVDS20_P, sheet U_HeaderB/BANK33_LVDS20_P
BANK33_LVDS21_N: sheet U_Bank0-13-33/BANK33_LVDS21_N, sheet U_HeaderB/BANK33_LVDS21_N
BANK33_LVDS21_P: sheet U_Bank0-13-33/BANK33_LVDS21_P, sheet U_HeaderB/BANK33_LVDS21_P
BANK33_LVDS22_N: sheet U_Bank0-13-33/BANK33_LVDS22_N, sheet U_HeaderB/BANK33_LVDS22_N
BANK33_LVDS22_P: sheet U_Bank0-13-33/BANK33_LVDS22_P, sheet U_HeaderB/BANK33_LVDS22_P
BANK33_LVDS23_N: sheet U_Bank0-13-33/BANK33_LVDS23_N, sheet U_HeaderB/BANK33_LVDS23_N
BANK33_LVDS23_P: sheet U_Bank0-13-33/BANK33_LVDS23_P, sheet U_HeaderB/BANK33_LVDS23_P
BANK33_LVDS24_N: sheet U_Bank0-13-33/BANK33_LVDS24_N, sheet U_HeaderB/BANK33_LVDS24_N
BANK33_LVDS24_P: sheet U_Bank0-13-33/BANK33_LVDS24_P, sheet U_HeaderB/BANK33_LVDS24_P
BANK34_IO_00: sheet U_Bank34-35/BANK34_IO_00, sheet U_HeaderC/BANK34_IO_00
BANK34_IO_25: sheet U_Bank34-35/BANK34_IO_25, sheet U_HeaderC/BANK34_IO_25
BANK34_LVDS01_N: sheet U_Bank34-35/BANK34_LVDS01_N, sheet U_HeaderC/BANK34_LVDS01_N
BANK34_LVDS01_P: sheet U_Bank34-35/BANK34_LVDS01_P, sheet U_HeaderC/BANK34_LVDS01_P
BANK34_LVDS02_N: sheet U_Bank34-35/BANK34_LVDS02_N, sheet U_HeaderC/BANK34_LVDS02_N
BANK34_LVDS02_P: sheet U_Bank34-35/BANK34_LVDS02_P, sheet U_HeaderC/BANK34_LVDS02_P
BANK34_LVDS03_N: sheet U_Bank34-35/BANK34_LVDS03_N, sheet U_HeaderC/BANK34_LVDS03_N
BANK34_LVDS03_P/PUDC: sheet U_Bank34-35/BANK34_LVDS03_P/PUDC, sheet U_HeaderC/BANK34_LVDS03_P/PUDC
BANK34_LVDS04_N: sheet U_Bank34-35/BANK34_LVDS04_N, sheet U_HeaderC/BANK34_LVDS04_N
BANK34_LVDS04_P: sheet U_Bank34-35/BANK34_LVDS04_P, sheet U_HeaderC/BANK34_LVDS04_P
BANK34_LVDS05_N: sheet U_Bank34-35/BANK34_LVDS05_N, sheet U_HeaderC/BANK34_LVDS05_N
BANK34_LVDS05_P: sheet U_Bank34-35/BANK34_LVDS05_P, sheet U_HeaderC/BANK34_LVDS05_P
BANK34_LVDS06_N: sheet U_Bank34-35/BANK34_LVDS06_N, sheet U_HeaderC/BANK34_LVDS06_N
BANK34_LVDS06_P: sheet U_Bank34-35/BANK34_LVDS06_P, sheet U_HeaderC/BANK34_LVDS06_P
BANK34_LVDS07_N: sheet U_Bank34-35/BANK34_LVDS07_N, sheet U_HeaderC/BANK34_LVDS07_N
BANK34_LVDS07_P: sheet U_Bank34-35/BANK34_LVDS07_P, sheet U_HeaderC/BANK34_LVDS07_P
BANK34_LVDS08_N: sheet U_Bank34-35/BANK34_LVDS08_N, sheet U_HeaderC/BANK34_LVDS08_N
BANK34_LVDS08_P: sheet U_Bank34-35/BANK34_LVDS08_P, sheet U_HeaderC/BANK34_LVDS08_P
BANK34_LVDS09_N: sheet U_Bank34-35/BANK34_LVDS09_N, sheet U_HeaderC/BANK34_LVDS09_N
BANK34_LVDS09_P: sheet U_Bank34-35/BANK34_LVDS09_P, sheet U_HeaderC/BANK34_LVDS09_P
BANK34_LVDS10_N: sheet U_Bank34-35/BANK34_LVDS10_N, sheet U_HeaderC/BANK34_LVDS10_N
BANK34_LVDS10_P: sheet U_Bank34-35/BANK34_LVDS10_P, sheet U_HeaderC/BANK34_LVDS10_P
BANK34_LVDS11_N: sheet U_Bank34-35/BANK34_LVDS11_N, sheet U_HeaderC/BANK34_LVDS11_N
BANK34_LVDS11_P: sheet U_Bank34-35/BANK34_LVDS11_P, sheet U_HeaderC/BANK34_LVDS11_P
BANK34_LVDS12/SYSCLK3_N: sheet U_Bank34-35/BANK34_LVDS12/SYSCLK3_N, sheet U_HeaderC/BANK34_LVDS12/SYSCLK3_N
BANK34_LVDS12/SYSCLK3_P: sheet U_Bank34-35/BANK34_LVDS12/SYSCLK3_P, sheet U_HeaderC/BANK34_LVDS12/SYSCLK3_P
BANK34_LVDS13_N: sheet U_Bank34-35/BANK34_LVDS13_N, sheet U_HeaderC/BANK34_LVDS13_N
BANK34_LVDS13_P: sheet U_Bank34-35/BANK34_LVDS13_P, sheet U_HeaderC/BANK34_LVDS13_P
BANK34_LVDS14_N: sheet U_Bank34-35/BANK34_LVDS14_N, sheet U_HeaderC/BANK34_LVDS14_N
BANK34_LVDS14_P: sheet U_Bank34-35/BANK34_LVDS14_P, sheet U_HeaderC/BANK34_LVDS14_P
BANK34_LVDS15_N: sheet U_Bank34-35/BANK34_LVDS15_N, sheet U_HeaderC/BANK34_LVDS15_N
BANK34_LVDS15_P: sheet U_Bank34-35/BANK34_LVDS15_P, sheet U_HeaderC/BANK34_LVDS15_P
BANK34_LVDS16_N: sheet U_Bank34-35/BANK34_LVDS16_N, sheet U_HeaderC/BANK34_LVDS16_N
BANK34_LVDS16_P: sheet U_Bank34-35/BANK34_LVDS16_P, sheet U_HeaderC/BANK34_LVDS16_P
BANK34_LVDS17_N: sheet U_Bank34-35/BANK34_LVDS17_N, sheet U_HeaderC/BANK34_LVDS17_N
BANK34_LVDS17_P: sheet U_Bank34-35/BANK34_LVDS17_P, sheet U_HeaderC/BANK34_LVDS17_P
BANK34_LVDS18_N: sheet U_Bank34-35/BANK34_LVDS18_N, sheet U_HeaderC/BANK34_LVDS18_N
BANK34_LVDS18_P: sheet U_Bank34-35/BANK34_LVDS18_P, sheet U_HeaderC/BANK34_LVDS18_P
BANK34_LVDS19_N: sheet U_Bank34-35/BANK34_LVDS19_N, sheet U_HeaderC/BANK34_LVDS19_N
BANK34_LVDS19_P: sheet U_Bank34-35/BANK34_LVDS19_P, sheet U_HeaderC/BANK34_LVDS19_P
BANK34_LVDS20_N: sheet U_Bank34-35/BANK34_LVDS20_N, sheet U_HeaderC/BANK34_LVDS20_N
BANK34_LVDS20_P: sheet U_Bank34-35/BANK34_LVDS20_P, sheet U_HeaderC/BANK34_LVDS20_P
BANK34_LVDS21_N: sheet U_Bank34-35/BANK34_LVDS21_N, sheet U_HeaderC/BANK34_LVDS21_N
BANK34_LVDS21_P: sheet U_Bank34-35/BANK34_LVDS21_P, sheet U_HeaderC/BANK34_LVDS21_P
BANK34_LVDS22_N: sheet U_Bank34-35/BANK34_LVDS22_N, sheet U_HeaderC/BANK34_LVDS22_N
BANK34_LVDS22_P: sheet U_Bank34-35/BANK34_LVDS22_P, sheet U_HeaderC/BANK34_LVDS22_P
BANK34_LVDS23_N: sheet U_Bank34-35/BANK34_LVDS23_N, sheet U_HeaderC/BANK34_LVDS23_N
BANK34_LVDS23_P: sheet U_Bank34-35/BANK34_LVDS23_P, sheet U_HeaderC/BANK34_LVDS23_P
BANK34_LVDS24_N: sheet U_Bank34-35/BANK34_LVDS24_N, sheet U_HeaderC/BANK34_LVDS24_N
BANK34_LVDS24_P: sheet U_Bank34-35/BANK34_LVDS24_P, sheet U_HeaderC/BANK34_LVDS24_P
BANK35_IO_00: sheet U_Bank34-35/BANK35_IO_00, sheet U_HeaderC/BANK35_IO_00
BANK35_IO_25: sheet U_Bank34-35/BANK35_IO_25, sheet U_HeaderC/BANK35_IO_25
BANK35_LVDS04_N: sheet U_Bank34-35/BANK35_LVDS04_N, sheet U_HeaderC/BANK35_LVDS04_N
BANK35_LVDS04_P: sheet U_Bank34-35/BANK35_LVDS04_P, sheet U_HeaderC/BANK35_LVDS04_P
BANK35_LVDS06_N/VREF: sheet U_Bank34-35/BANK35_LVDS06_N/VREF, sheet U_HeaderC/BANK35_LVDS06_N/VREF
BANK35_LVDS06_P: sheet U_Bank34-35/BANK35_LVDS06_P, sheet U_HeaderC/BANK35_LVDS06_P
BANK35_LVDS11_N: sheet U_Bank34-35/BANK35_LVDS11_N, sheet U_HeaderC/BANK35_LVDS11_N
BANK35_LVDS11_P: sheet U_Bank34-35/BANK35_LVDS11_P, sheet U_HeaderC/BANK35_LVDS11_P
BANK35_LVDS12/SYSCLK0_N: sheet U_Bank34-35/BANK35_LVDS12/SYSCLK0_N, sheet U_HeaderC/BANK35_LVDS12/SYSCLK0_N
BANK35_LVDS12/SYSCLK0_P: sheet U_Bank34-35/BANK35_LVDS12/SYSCLK0_P, sheet U_HeaderC/BANK35_LVDS12/SYSCLK0_P
BANK35_LVDS13_N: sheet U_Bank34-35/BANK35_LVDS13_N, sheet U_HeaderC/BANK35_LVDS13_N
BANK35_LVDS13_P: sheet U_Bank34-35/BANK35_LVDS13_P, sheet U_HeaderC/BANK35_LVDS13_P
BANK35_LVDS16_N: sheet U_Bank34-35/BANK35_LVDS16_N, sheet U_HeaderC/BANK35_LVDS16_N
BANK35_LVDS16_P: sheet U_Bank34-35/BANK35_LVDS16_P, sheet U_HeaderC/BANK35_LVDS16_P
BANK35_LVDS19_N/VREF: sheet U_Bank34-35/BANK35_LVDS19_N/VREF, sheet U_HeaderC/BANK35_LVDS19_N/VREF
BANK35_LVDS19_P: sheet U_Bank34-35/BANK35_LVDS19_P, sheet U_HeaderC/BANK35_LVDS19_P
BANK35_LVDS23_N: sheet U_Bank34-35/BANK35_LVDS23_N, sheet U_HeaderC/BANK35_LVDS23_N
BANK35_LVDS23_P: sheet U_Bank34-35/BANK35_LVDS23_P, sheet U_HeaderC/BANK35_LVDS23_P
CARRIER_SRST_B: sheet U_HeaderC/CARRIER_SRST_B, sheet U_QSPIFlash/CARRIER_SRST_B
CONSOLE_UART_RX: sheet U_HeaderC/CONSOLE_UART_RX, sheet U_QSPIFlash/CONSOLE_UART_RX
CONSOLE_UART_TX: sheet U_HeaderC/CONSOLE_UART_TX, sheet U_QSPIFlash/CONSOLE_UART_TX
DAC_LD: sheet U_DAC/DAC_LD, sheet U_HeaderC/DAC_LD, sheet U_QSPIFlash/DAC_LD
DAC_OUT1: sheet U_DAC/DAC_OUT1, sheet U_HeaderA/DAC_OUT1
DAC_OUT2: sheet U_DAC/DAC_OUT2, sheet U_HeaderA/DAC_OUT2
DAC_OUT3: sheet U_DAC/DAC_OUT3, sheet U_HeaderA/DAC_OUT3
DAC_OUT4: sheet U_DAC/DAC_OUT4, sheet U_HeaderA/DAC_OUT4
DAC_OUT5: sheet U_DAC/DAC_OUT5, sheet U_HeaderA/DAC_OUT5
DAC_OUT6: sheet U_DAC/DAC_OUT6, sheet U_HeaderA/DAC_OUT6
DAC_OUT7: sheet U_DAC/DAC_OUT7, sheet U_HeaderA/DAC_OUT7
DAC_OUT8: sheet U_DAC/DAC_OUT8, sheet U_HeaderA/DAC_OUT8
DAC_OUT9: sheet U_DAC/DAC_OUT9, sheet U_HeaderA/DAC_OUT9
DAC_OUT10: sheet U_DAC/DAC_OUT10, sheet U_HeaderA/DAC_OUT10
DDR3_A0: sheet U_DDR3A/DDR3_A0, sheet U_DDR3B/DDR3_A0
DDR3_A1: sheet U_DDR3A/DDR3_A1, sheet U_DDR3B/DDR3_A1
DDR3_A2: sheet U_DDR3A/DDR3_A2, sheet U_DDR3B/DDR3_A2
DDR3_A3: sheet U_DDR3A/DDR3_A3, sheet U_DDR3B/DDR3_A3
DDR3_A4: sheet U_DDR3A/DDR3_A4, sheet U_DDR3B/DDR3_A4
DDR3_A5: sheet U_DDR3A/DDR3_A5, sheet U_DDR3B/DDR3_A5
DDR3_A6: sheet U_DDR3A/DDR3_A6, sheet U_DDR3B/DDR3_A6
DDR3_A7: sheet U_DDR3A/DDR3_A7, sheet U_DDR3B/DDR3_A7
DDR3_A8: sheet U_DDR3A/DDR3_A8, sheet U_DDR3B/DDR3_A8
DDR3_A9: sheet U_DDR3A/DDR3_A9, sheet U_DDR3B/DDR3_A9
DDR3_A10: sheet U_DDR3A/DDR3_A10, sheet U_DDR3B/DDR3_A10
DDR3_A11: sheet U_DDR3A/DDR3_A11, sheet U_DDR3B/DDR3_A11
DDR3_A12: sheet U_DDR3A/DDR3_A12, sheet U_DDR3B/DDR3_A12
DDR3_A13: sheet U_DDR3A/DDR3_A13, sheet U_DDR3B/DDR3_A13
DDR3_A14: sheet U_DDR3A/DDR3_A14, sheet U_DDR3B/DDR3_A14
DDR3_BA0: sheet U_DDR3A/DDR3_BA0, sheet U_DDR3B/DDR3_BA0
DDR3_BA1: sheet U_DDR3A/DDR3_BA1, sheet U_DDR3B/DDR3_BA1
DDR3_BA2: sheet U_DDR3A/DDR3_BA2, sheet U_DDR3B/DDR3_BA2
DDR3_CAS_B: sheet U_DDR3A/DDR3_CAS_B, sheet U_DDR3B/DDR3_CAS_B
DDR3_CK0_N: sheet U_DDR3A/DDR3_CK0_N, sheet U_DDR3B/DDR3_CK0_N
DDR3_CK0_P: sheet U_DDR3A/DDR3_CK0_P, sheet U_DDR3B/DDR3_CK0_P
DDR3_CKE: sheet U_DDR3A/DDR3_CKE, sheet U_DDR3B/DDR3_CKE
DDR3_CS_B: sheet U_DDR3A/DDR3_CS_B, sheet U_DDR3B/DDR3_CS_B
DDR3_DM2: sheet U_DDR3A/DDR3_DM2, sheet U_DDR3B/DDR3_DM2
DDR3_DM3: sheet U_DDR3A/DDR3_DM3, sheet U_DDR3B/DDR3_DM3
DDR3_DQ16: sheet U_DDR3A/DDR3_DQ16, sheet U_DDR3B/DDR3_DQ16
DDR3_DQ17: sheet U_DDR3A/DDR3_DQ17, sheet U_DDR3B/DDR3_DQ17
DDR3_DQ18: sheet U_DDR3A/DDR3_DQ18, sheet U_DDR3B/DDR3_DQ18
DDR3_DQ19: sheet U_DDR3A/DDR3_DQ19, sheet U_DDR3B/DDR3_DQ19
DDR3_DQ20: sheet U_DDR3A/DDR3_DQ20, sheet U_DDR3B/DDR3_DQ20
DDR3_DQ21: sheet U_DDR3A/DDR3_DQ21, sheet U_DDR3B/DDR3_DQ21
DDR3_DQ22: sheet U_DDR3A/DDR3_DQ22, sheet U_DDR3B/DDR3_DQ22
DDR3_DQ23: sheet U_DDR3A/DDR3_DQ23, sheet U_DDR3B/DDR3_DQ23
DDR3_DQ24: sheet U_DDR3A/DDR3_DQ24, sheet U_DDR3B/DDR3_DQ24
DDR3_DQ25: sheet U_DDR3A/DDR3_DQ25, sheet U_DDR3B/DDR3_DQ25
DDR3_DQ26: sheet U_DDR3A/DDR3_DQ26, sheet U_DDR3B/DDR3_DQ26
DDR3_DQ27: sheet U_DDR3A/DDR3_DQ27, sheet U_DDR3B/DDR3_DQ27
DDR3_DQ28: sheet U_DDR3A/DDR3_DQ28, sheet U_DDR3B/DDR3_DQ28
DDR3_DQ29: sheet U_DDR3A/DDR3_DQ29, sheet U_DDR3B/DDR3_DQ29
DDR3_DQ30: sheet U_DDR3A/DDR3_DQ30, sheet U_DDR3B/DDR3_DQ30
DDR3_DQ31: sheet U_DDR3A/DDR3_DQ31, sheet U_DDR3B/DDR3_DQ31
DDR3_DQS2_N: sheet U_DDR3A/DDR3_DQS2_N, sheet U_DDR3B/DDR3_DQS2_N
DDR3_DQS2_P: sheet U_DDR3A/DDR3_DQS2_P, sheet U_DDR3B/DDR3_DQS2_P
DDR3_DQS3_N: sheet U_DDR3A/DDR3_DQS3_N, sheet U_DDR3B/DDR3_DQS3_N
DDR3_DQS3_P: sheet U_DDR3A/DDR3_DQS3_P, sheet U_DDR3B/DDR3_DQS3_P
DDR3_ODT: sheet U_DDR3A/DDR3_ODT, sheet U_DDR3B/DDR3_ODT
DDR3_RAS_B: sheet U_DDR3A/DDR3_RAS_B, sheet U_DDR3B/DDR3_RAS_B
DDR3_RESET_B: sheet U_DDR3A/DDR3_RESET_B, sheet U_DDR3B/DDR3_RESET_B
DDR3_WE_B: sheet U_DDR3A/DDR3_WE_B, sheet U_DDR3B/DDR3_WE_B
DEV_ID0: sheet U_HeaderC/DEV_ID0, sheet U_QSPIFlash/DEV_ID0
DEV_ID1: sheet U_HeaderC/DEV_ID1, sheet U_QSPIFlash/DEV_ID1
DUT_PRESENT_N: sheet U_HeaderC/DUT_PRESENT_N, sheet U_QSPIFlash/DUT_PRESENT_N
ETH_MDC: sheet U_Ethernet/ETH_MDC, sheet U_QSPIFlash/ETH_MDC
ETH_MDIO: sheet U_Ethernet/ETH_MDIO, sheet U_QSPIFlash/ETH_MDIO
ETH_RX_CLK: sheet U_Ethernet/ETH_RX_CLK, sheet U_QSPIFlash/ETH_RX_CLK
ETH_RX_CTRL: sheet U_Ethernet/ETH_RX_CTRL, sheet U_QSPIFlash/ETH_RX_CTRL
ETH_RXD0: sheet U_Ethernet/ETH_RXD0, sheet U_QSPIFlash/ETH_RXD0
ETH_RXD1: sheet U_Ethernet/ETH_RXD1, sheet U_QSPIFlash/ETH_RXD1
ETH_RXD2: sheet U_Ethernet/ETH_RXD2, sheet U_QSPIFlash/ETH_RXD2
ETH_RXD3: sheet U_Ethernet/ETH_RXD3, sheet U_QSPIFlash/ETH_RXD3
ETH_TX_CLK: sheet U_Ethernet/ETH_TX_CLK, sheet U_QSPIFlash/ETH_TX_CLK
ETH_TX_CTRL: sheet U_Ethernet/ETH_TX_CTRL, sheet U_QSPIFlash/ETH_TX_CTRL
ETH_TXD0: sheet U_Ethernet/ETH_TXD0, sheet U_QSPIFlash/ETH_TXD0
ETH_TXD1: sheet U_Ethernet/ETH_TXD1, sheet U_QSPIFlash/ETH_TXD1
ETH_TXD2: sheet U_Ethernet/ETH_TXD2, sheet U_QSPIFlash/ETH_TXD2
ETH_TXD3: sheet U_Ethernet/ETH_TXD3, sheet U_QSPIFlash/ETH_TXD3
FPGA_DONE: sheet U_Bank0-13-33/FPGA_DONE, sheet U_HeaderC/FPGA_DONE
I2C0_SCL: sheet U_HeaderC/I2C0_SCL, sheet U_IOPower/I2C0_SCL, sheet U_QSPIFlash/I2C0_SCL
I2C0_SDA: sheet U_HeaderC/I2C0_SDA, sheet U_IOPower/I2C0_SDA, sheet U_QSPIFlash/I2C0_SDA
I2C1_SCL/MIO12: sheet U_HeaderC/I2C1_SCL/MIO12, sheet U_QSPIFlash/I2C1_SCL/MIO12
I2C1_SDA/MIO13: sheet U_HeaderC/I2C1_SDA/MIO13, sheet U_QSPIFlash/I2C1_SDA/MIO13
INIT_B: sheet U_Bank0-13-33/INIT_B, sheet U_HeaderC/INIT_B
JTAG_RST_B: sheet U_Bank0-13-33/JTAG_RST_B, sheet U_QSPIFlash/JTAG_RST_B
MIO15: sheet U_HeaderC/MIO15, sheet U_QSPIFlash/MIO15
MIO47: sheet U_HeaderC/MIO47, sheet U_QSPIFlash/MIO47
PG_1V8: sheet U_HeaderC/PG_1V8, sheet U_Power/PG_1V8
PHY_RESET_B_AND: sheet U_Ethernet/PHY_RESET_B_AND, sheet U_QSPIFlash/PHY_RESET_B_AND
POWER_GOOD: sheet U_Ethernet/POWER_GOOD, sheet U_QSPIFlash/POWER_GOOD, sheet U_Power/POWER_GOOD
PWR_ENABLE: sheet U_HeaderC/PWR_ENABLE, sheet U_Power/PWR_ENABLE
SMBUS_ALERT_N: sheet U_HeaderC/SMBUS_ALERT_N, sheet U_QSPIFlash/SMBUS_ALERT_N
SPI0_MISO_SLAVE0: sheet U_DAC/SPI0_MISO_SLAVE0, sheet U_QSPIFlash/SPI0_MISO_SLAVE0
SPI0_MISO_SLAVE1: sheet U_ADC/SPI0_MISO_SLAVE1, sheet U_QSPIFlash/SPI0_MISO_SLAVE1
SPI0_MISO_SLAVE2: sheet U_HeaderC/SPI0_MISO_SLAVE2, sheet U_QSPIFlash/SPI0_MISO_SLAVE2
SPI0_MOSI: sheet U_ADC/SPI0_MOSI, sheet U_DAC/SPI0_MOSI, sheet U_HeaderC/SPI0_MOSI, sheet U_QSPIFlash/SPI0_MOSI
SPI0_SCLK: sheet U_ADC/SPI0_SCLK, sheet U_DAC/SPI0_SCLK, sheet U_HeaderC/SPI0_SCLK, sheet U_QSPIFlash/SPI0_SCLK
SPI0_SS1: sheet U_ADC/SPI0_SS1, sheet U_QSPIFlash/SPI0_SS1
SPI0_SS2: sheet U_HeaderC/SPI0_SS2, sheet U_QSPIFlash/SPI0_SS2
SPI1_MISO_SLAVE0: sheet U_HeaderC/SPI1_MISO_SLAVE0, sheet U_QSPIFlash/SPI1_MISO_SLAVE0
SPI1_MISO_SLAVE1: sheet U_HeaderC/SPI1_MISO_SLAVE1, sheet U_QSPIFlash/SPI1_MISO_SLAVE1
SPI1_MISO_SLAVE2: sheet U_HeaderC/SPI1_MISO_SLAVE2, sheet U_QSPIFlash/SPI1_MISO_SLAVE2
SPI1_MOSI: sheet U_HeaderC/SPI1_MOSI, sheet U_QSPIFlash/SPI1_MOSI
SPI1_SCLK: sheet U_HeaderC/SPI1_SCLK, sheet U_QSPIFlash/SPI1_SCLK
SPI1_SS0: sheet U_HeaderC/SPI1_SS0, sheet U_QSPIFlash/SPI1_SS0
SPI1_SS1: sheet U_HeaderC/SPI1_SS1, sheet U_QSPIFlash/SPI1_SS1
SPI1_SS2: sheet U_HeaderC/SPI1_SS2, sheet U_QSPIFlash/SPI1_SS2
STATUS_LED: sheet U_HeaderC/STATUS_LED, sheet U_QSPIFlash/STATUS_LED

### Notes on the sheet
- REV.
- DESCRIPTION
- DATE
- APPROVED
- TITLE
- Incal Inc.
- SHEET
- CONFIG.
- PROJECT
- SIZE
- C
- SCH P/N.
- DRAWN
- OF